# Altium project nrf21540_qdaa_var2.PrjPCB
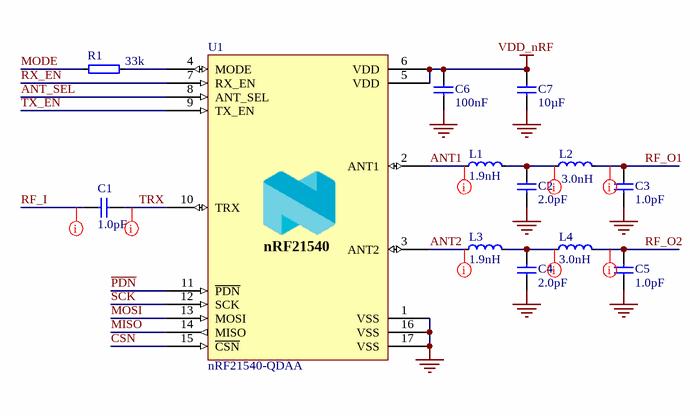
[diagram p0: nrf21540_qdaa_var2.SchDoc]
1 sheet, 13 parts. Net scope: global (net labels, ports and power ports of the same name join across sheets).
Board file: nrf21540_qdaa_var2.PcbDoc

## Sheet nrf21540_qdaa_var2.SchDoc: nRF21540 Reference Layout Alt. 2
size A4; Revision: 1.0; SheetNumber: 1; SheetTotal: 1; DrawnBy: HANY; DocumentSize: A4; PCAName: nRF21540 Reference Layout Alt. 2; BoardTitle: nRF21540 Reference Layout Alt. 2

### Parts
C1  1.0pF  [CAPC0603X03L_C]
C2  2.0pF  [CAPC0603X03L_C]
C3  1.0pF  [CAPC0603X03L_C]
C4  2.0pF  [CAPC0603X03L_C]
C5  1.0pF  [CAPC0603X03L_C]
C6  100nF  [CAPC0603X03L_C]
C7  10µF  [CAPC1608X06L]
L1  1.9nH  [INDC0603X03L_C]
L2  3.0nH  [INDC0603X03L_C]
L3  1.9nH  [INDC0603X03L_C]
L4  3.0nH  [INDC0603X03L_C]
R1  33k  [RESC0603X03L_C]
U1  nRF21540-QDAA  [QFN65P400X400X65_HS-17N]

### Nets
GND: C2.1 C3.1 C4.1 C5.1 C6.1 C7.1 U1.1(VSS) U1.16(VSS) U1.17(VSS)
VDD_nRF: C6.2 C7.2 U1.5(VDD) U1.6(VDD)
ANT1: L1.1 U1.2(ANT1)
ANT2: L3.1 U1.3(ANT2)
ANT_SEL: U1.8(ANT_SEL)
~{CSN}: U1.15(~{CSN})
MISO: U1.14(MISO)
MODE: R1.1
MOSI: U1.13(MOSI)
~{PDN}: U1.11(~{PDN})
RF_I: C1.1
RF_O1: C3.2 L2.2
RF_O2: C5.2 L4.2
RX_EN: U1.7(RX_EN)
SCK: U1.12(SCK)
TRX: C1.2 U1.10(TRX)
TX_EN: U1.9(TX_EN)
NetC2_2: C2.2 L1.2 L2.1
NetC4_2: C4.2 L3.2 L4.1
NetR1_2: R1.2 U1.4(MODE)

### Layout directives
net class ANT: ANT1, ANT2, NetC2_2, NetC4_2, RF_I, RF_O1, RF_O2, TRX

### Notes on the sheet
- Title
- Size
- Date:
- A4
- Project Number
- Sheet         of
- Revision
- File:
- Drawn By:
- (in symbol nRF21540-QDAA) nRF21540

### Library data of the parts
C1 C3 C5 = C0201-1.0p: Capacitor, NP0, ±0.05pF, 50V; Pad Count: 2; Part Number: C0201-1.0p; Value: 1.0pF; Author: rsk; Note: 50V; Footprint Doc: 0201
C2 C4 = C0201-2.0p-HQ-Murata: Capacitor, NP0, ±0.05pF, 25V; Pad Count: 2; Part Number: C0201-2.0p-HQ-Murata; Value: 2.0pF; Author: rsk; Note: 25V; Footprint Doc: 0201
C6 = C0201-100n: Capacitor, X5R, ±10%; Pad Count: 2; Note: 16V; Part Number: C0201-100n; Value: 100nF; Author: rsk; Footprint Doc: 0201
C7 = C0603-10µ: Capacitor, X5R, ±20%; Pad Count: 2; Note: 6.3V; Part Number: C0603-10µ; Value: 10µF; Author: rsk; Footprint Doc: 0603
L1 L3 = L0201-1n9-HQ-Murata: Inductor, 600mA, ±0.1ｎH, 120mOhm; Pad Count: 2; Note: -55°C ~ 125°C; Part Number: L0201-1n9-HQ-Murata; Value: 1.9nH; Author: rsk; Footprint Doc: 0201
L2 L4 = L0201-3n0-HQ-Murata: Inductor, 600mA, ±0.1ｎH, 120mOhm; Pad Count: 2; Note: -55°C ~ 125°C; Part Number: L0201-3n0-HQ-Murata; Value: 3.0nH; Author: rsk; Footprint Doc: 0201
R1 = R0201-33k: Resistor, ±1%, 0.05W; Pad Count: 2; Note: Chip Res 1%; Part Number: R0201-33k; Author: rsk; Value: 33k; Footprint Doc: 0201
U1 = nRF21540-QDAA: Radio front-end / range extender for 2.4GHz; Note: N.A.; Pad Count: 16; Part Number: nRF21540-QDAA; Value: nRF21540-QDAA; Author: rsk; Footprint Doc: QFN-16